# EAGLE design sd (EAGLE 6.4)
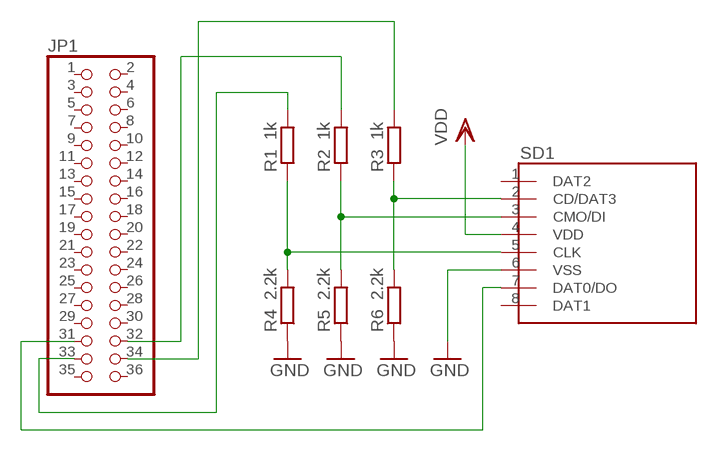
[diagram p0: schematic, sheet 1]

## Parts
JP1  PINHD-2X18  [2X18]
R1  1k  R-EU_0204/2V  [0204V]
R2  1k  R-EU_0204/2V  [0204V]
R3  1k  R-EU_0204/2V  [0204V]
R4  2.2k  R-EU_0204/2V  [0204V]
R5  2.2k  R-EU_0204/2V  [0204V]
R6  2.2k  R-EU_0204/2V  [0204V]
SD1  CK-40  [SD]

## Nets
GND: R4.1 R5.1 R6.1 SD1.6(VSS)
N$2: R3.1 R6.2 SD1.2(CD/DAT3)
N$3: R2.1 R5.2 SD1.3(CMO/DI)
N$5: R1.1 R4.2 SD1.5(CLK)
N$6: JP1.32 R2.2
N$7: JP1.34 R3.2
N$9: JP1.33 R1.2
N$10: JP1.31 SD1.7(DAT0/DO)
VDD: SD1.4(VDD)
Unconnected: JP1.1 JP1.2 JP1.3 JP1.4 JP1.5 JP1.6 JP1.7 JP1.8 JP1.9 JP1.10 JP1.11 JP1.12 JP1.13 JP1.14 JP1.15 JP1.16 JP1.17 JP1.18 JP1.19 JP1.20 JP1.21 JP1.22 JP1.23 JP1.24 JP1.25 JP1.26 JP1.27 JP1.28 JP1.29 JP1.30 JP1.35 JP1.36 SD1.1(DAT2) SD1.8(DAT1)

## Library data of the parts
JP1 = pinhead:PINHD-2X18: PIN HEADER
R1-R6 = rcl:R-EU_: RESISTOR, European symbol
SD1 = my_SD:CK-40: SD Module

## Board
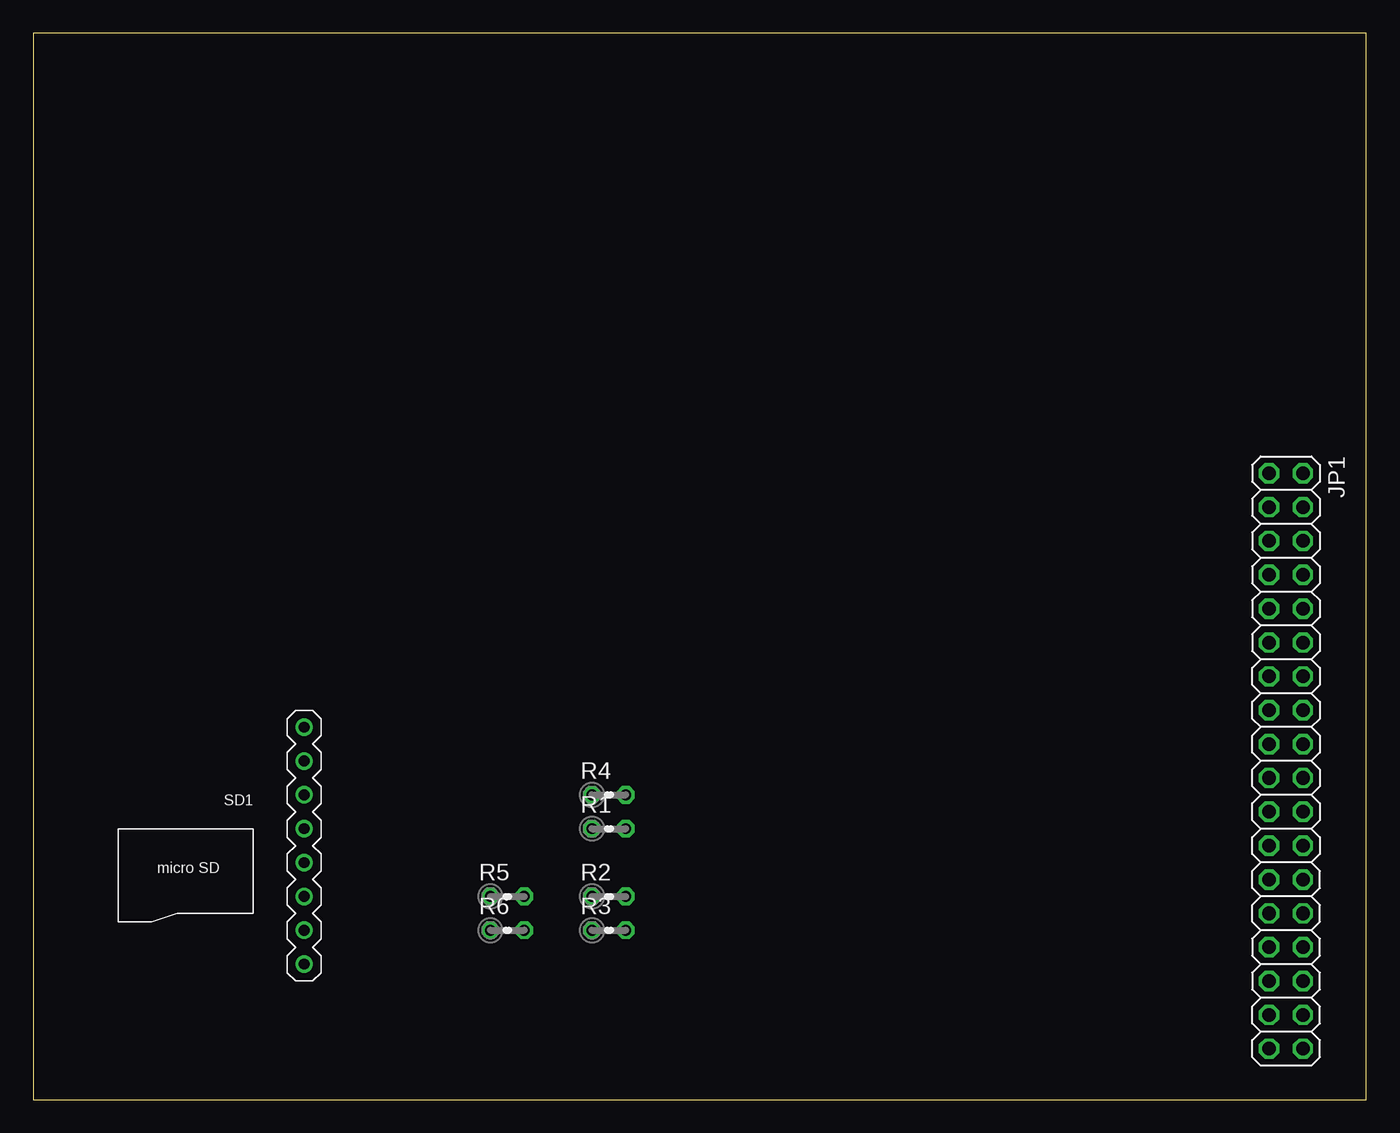
[diagram p1: board, top side]
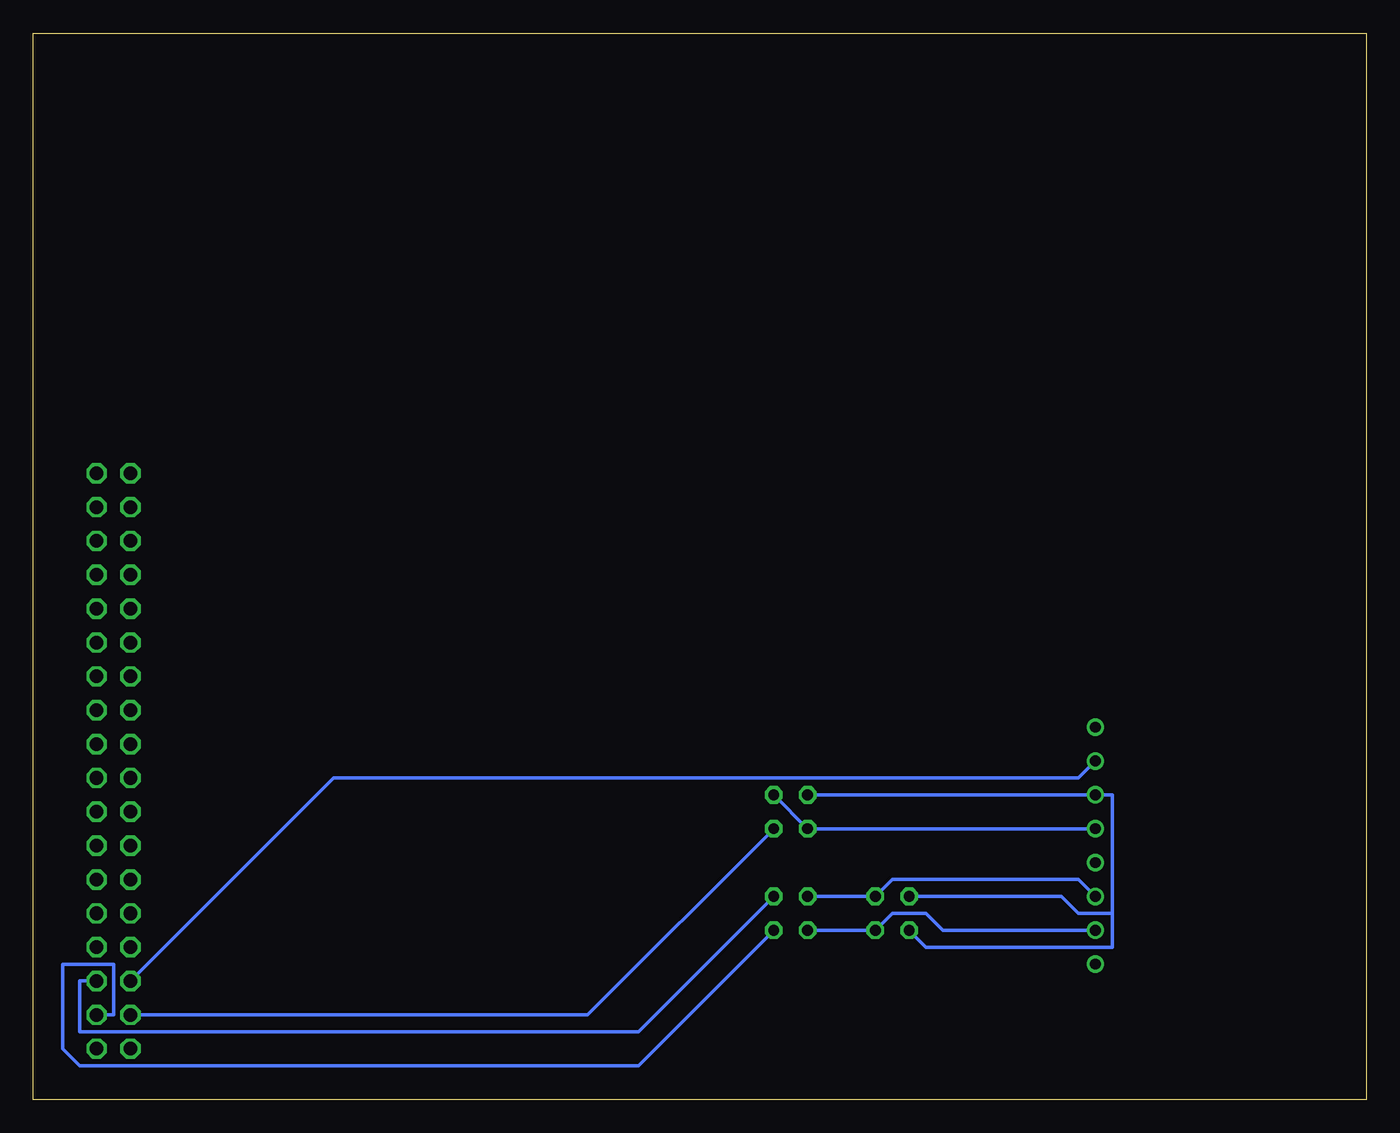
[diagram p2: board, bottom side, seen from below]

Size 100 x 80 mm. Coordinates in mm from the lower left corner, seen from the top.
Outline: 0,0 100,0 100,80 0,80 0,0
Copper layers (1*16): Top 0.035mm / dielectric 1.5mm / Bottom 0.035mm
Design rules "default": minimum track width 10mil, minimum drill 24mil, track to track 8mil, track to pad 8mil, pad to pad 8mil, via to via 8mil, smd to smd 8mil, copper to edge 40mil, drill to drill 8mil, minimum pad ring 10mil, minimum via ring 8mil, stop-mask expansion 4mil, vias tented up to drill 0mil, thermal gap 10mil

### Footprints (pad centres in the part's own frame; a part is rotated, then mirrored left to right if it is on the bottom)
2X18 = drill 1.016 octagon: 1 -21.59,-1.27; 2 -21.59,1.27; 3 -19.05,-1.27; 4 -19.05,1.27; 5 -16.51,-1.27; 6 -16.51,1.27; 7 -13.97,-1.27; 8 -13.97,1.27; 9 -11.43,-1.27; 10 -11.43,1.27; 11 -8.89,-1.27; 12 -8.89,1.27; 13 -6.35,-1.27; 14 -6.35,1.27; 15 -3.81,-1.27; 16 -3.81,1.27; 17 -1.27,-1.27; 18 -1.27,1.27; 19 1.27,-1.27; 20 1.27,1.27; 21 3.81,-1.27; 22 3.81,1.27; 23 6.35,-1.27; 24 6.35,1.27; 25 8.89,-1.27; 26 8.89,1.27; 27 11.43,-1.27; 28 11.43,1.27; 29 13.97,-1.27; 30 13.97,1.27; 31 16.51,-1.27; 32 16.51,1.27; 33 19.05,-1.27; 34 19.05,1.27; 35 21.59,-1.27; 36 21.59,1.27
0204V = drill 0.813 octagon: 1 -1.27,0; 2 1.27,0
SD = drill 0.8: 1 0,7.62; 2 0,5.08; 3 0,2.54; 4 0,0; 5 0,-2.54; 6 0,-5.08; 7 0,-7.62; 8 0,-10.16

### Placement (x,y rotation side)
JP1  93.98,25.4 270 top
R1  43.18,20.32 0 top
R2  43.18,15.24 0 top
R3  43.18,12.7 0 top
R4  43.18,22.86 0 top
R5  35.56,15.24 0 top
R6  35.56,12.7 0 top
SD1  20.32,17.78 180 top

### Tracks (layer width: path | path; a pad name or v marks a point on that pad's centre or on a via)
GND
  Bottom 0.254: 19.05,13.97 19.05,22.86 SD1.6 R4.1 | 19.05,13.97 19.05,11.43 33.02,11.43 R6.1 | 19.05,13.97 21.59,13.97 22.86,15.24 R5.1
N$2
  Bottom 0.254: SD1.2 31.75,12.7 33.02,13.97 35.56,13.97 R6.2 R3.1
N$3
  Bottom 0.254: SD1.3 21.59,16.51 35.56,16.51 R5.2 R2.1
N$5
  Bottom 0.254: SD1.5 R1.1 R4.2
N$6
  Bottom 0.254: R2.2 54.61,5.08 96.52,5.08 96.52,8.89 JP1.32
N$7
  Bottom 0.254: R3.2 54.61,2.54 96.52,2.54 97.79,3.81 97.79,10.16 93.98,10.16 93.98,6.35 JP1.34
N$9
  Bottom 0.254: R1.2 58.42,6.35 JP1.33
N$10
  Bottom 0.254: SD1.7 21.59,24.13 77.47,24.13 JP1.31